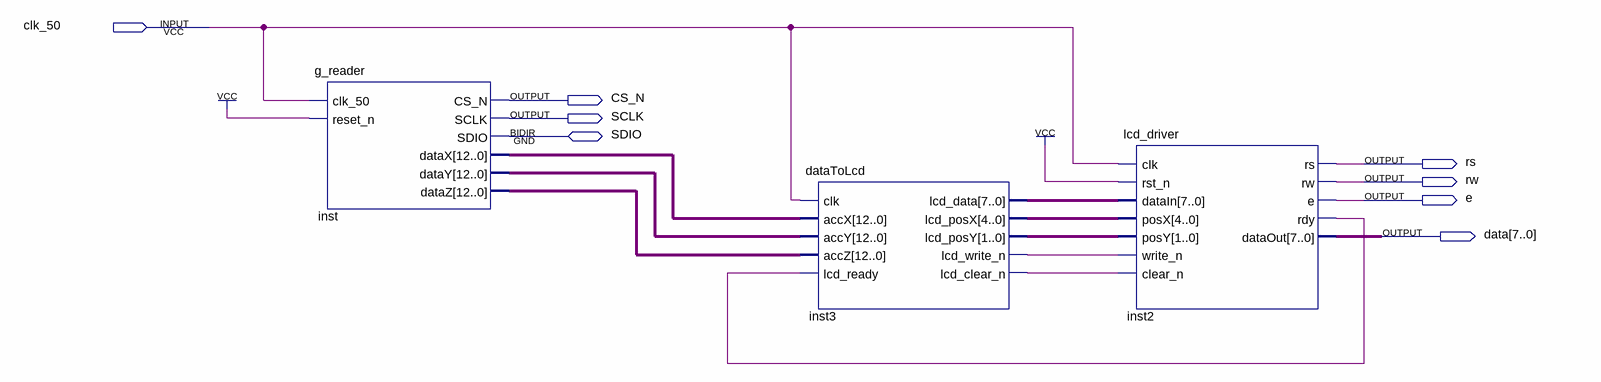
[diagram p0: schematic sheet]
// Quartus schematic gSensorToLCD.bdf as structural Verilog: 3 symbols, 8 pins
module gSensorToLCD (
  input  clk_50,
  inout  SDIO,
  output CS_N,
  output SCLK,
  output rs,
  output rw,
  output e,
  output [7:0] data
);

  wire inst2_rdy, inst3_lcd_clear_n, inst3_lcd_write_n;
  wire [1:0] inst3_lcd_posy;
  wire [4:0] inst3_lcd_posx;
  wire [7:0] inst3_lcd_data;
  wire [12:0] inst_datax, inst_datay, inst_dataz;

  g_reader inst (
    .clk_50(clk_50), .reset_n(1'b1), .CS_N(CS_N), .SCLK(SCLK), .dataX(inst_datax), .dataY(inst_datay),
    .dataZ(inst_dataz), .SDIO(SDIO));
  dataToLcd inst3 (
    .clk(clk_50), .accX(inst_datax), .accY(inst_datay), .accZ(inst_dataz), .lcd_ready(inst2_rdy),
    .lcd_data(inst3_lcd_data), .lcd_posX(inst3_lcd_posx), .lcd_posY(inst3_lcd_posy),
    .lcd_write_n(inst3_lcd_write_n), .lcd_clear_n(inst3_lcd_clear_n));
  lcd_driver inst2 (
    .clk(clk_50), .rst_n(1'b1), .dataIn(inst3_lcd_data), .posX(inst3_lcd_posx), .posY(inst3_lcd_posy),
    .write_n(inst3_lcd_write_n), .clear_n(inst3_lcd_clear_n), .rs(rs), .rw(rw), .e(e), .rdy(inst2_rdy),
    .dataOut(data));
endmodule
